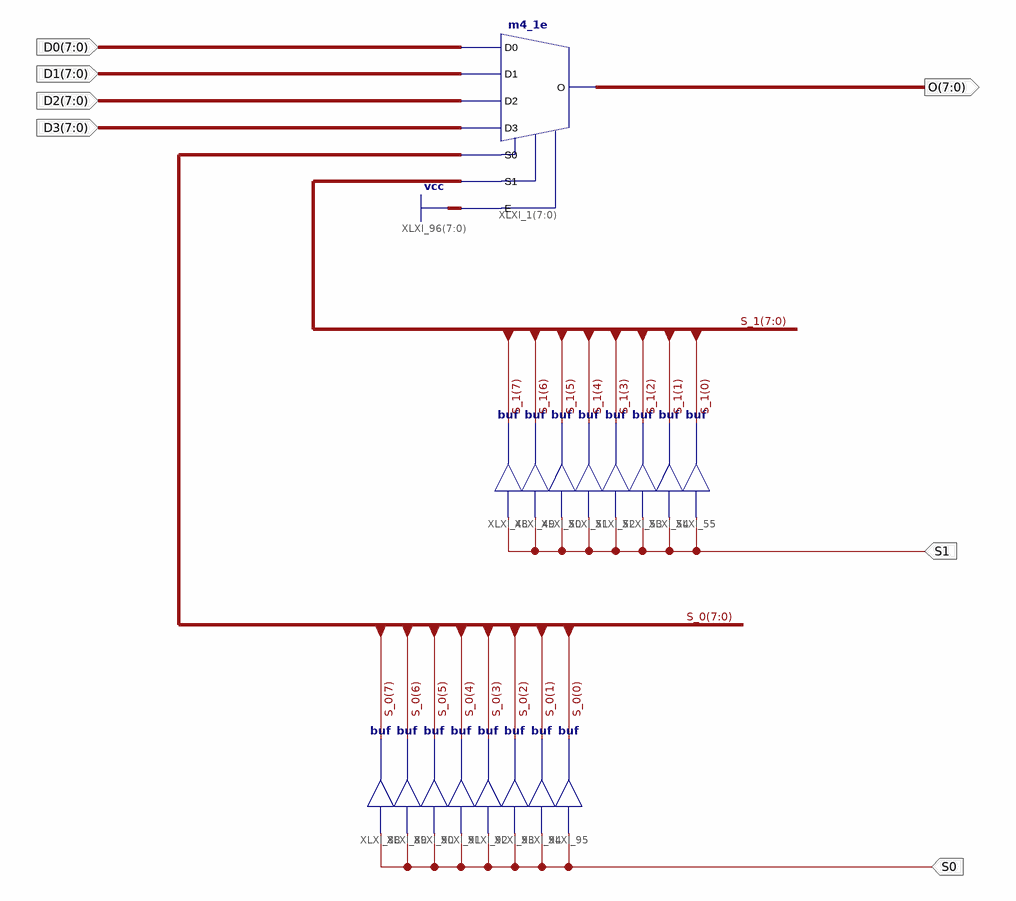
[diagram p0: schematic sheet 1]
// Xilinx ISE schematic m4_1_8bit.sch (spartan3e) as structural Verilog: 17 symbols, 7 ports
module m4_1_8bit (
  input  S1,
  input  S0,
  input  [7:0] D0,
  input  [7:0] D1,
  input  [7:0] D2,
  input  [7:0] D3,
  output [7:0] O
);

  wire [7:0] S_0, S_1;

  buf XLXI_48 (S_1[7], S1);
  buf XLXI_49 (S_1[6], S1);
  buf XLXI_50 (S_1[5], S1);
  buf XLXI_51 (S_1[4], S1);
  buf XLXI_52 (S_1[3], S1);
  buf XLXI_53 (S_1[2], S1);
  buf XLXI_54 (S_1[1], S1);
  buf XLXI_55 (S_1[0], S1);
  buf XLXI_88 (S_0[7], S0);
  buf XLXI_89 (S_0[6], S0);
  buf XLXI_90 (S_0[5], S0);
  buf XLXI_91 (S_0[4], S0);
  buf XLXI_92 (S_0[3], S0);
  buf XLXI_93 (S_0[2], S0);
  buf XLXI_94 (S_0[1], S0);
  buf XLXI_95 (S_0[0], S0);
  m4_1e XLXI_1[7:0] (.D0(D0), .D1(D1), .D2(D2), .D3(D3), .E({8{1'b1}}), .S0(S_0), .S1(S_1), .O(O));
endmodule
